# EAGLE schematic precharge_schematic (EAGLE 9.6.2)

## Sheet 1 of 2
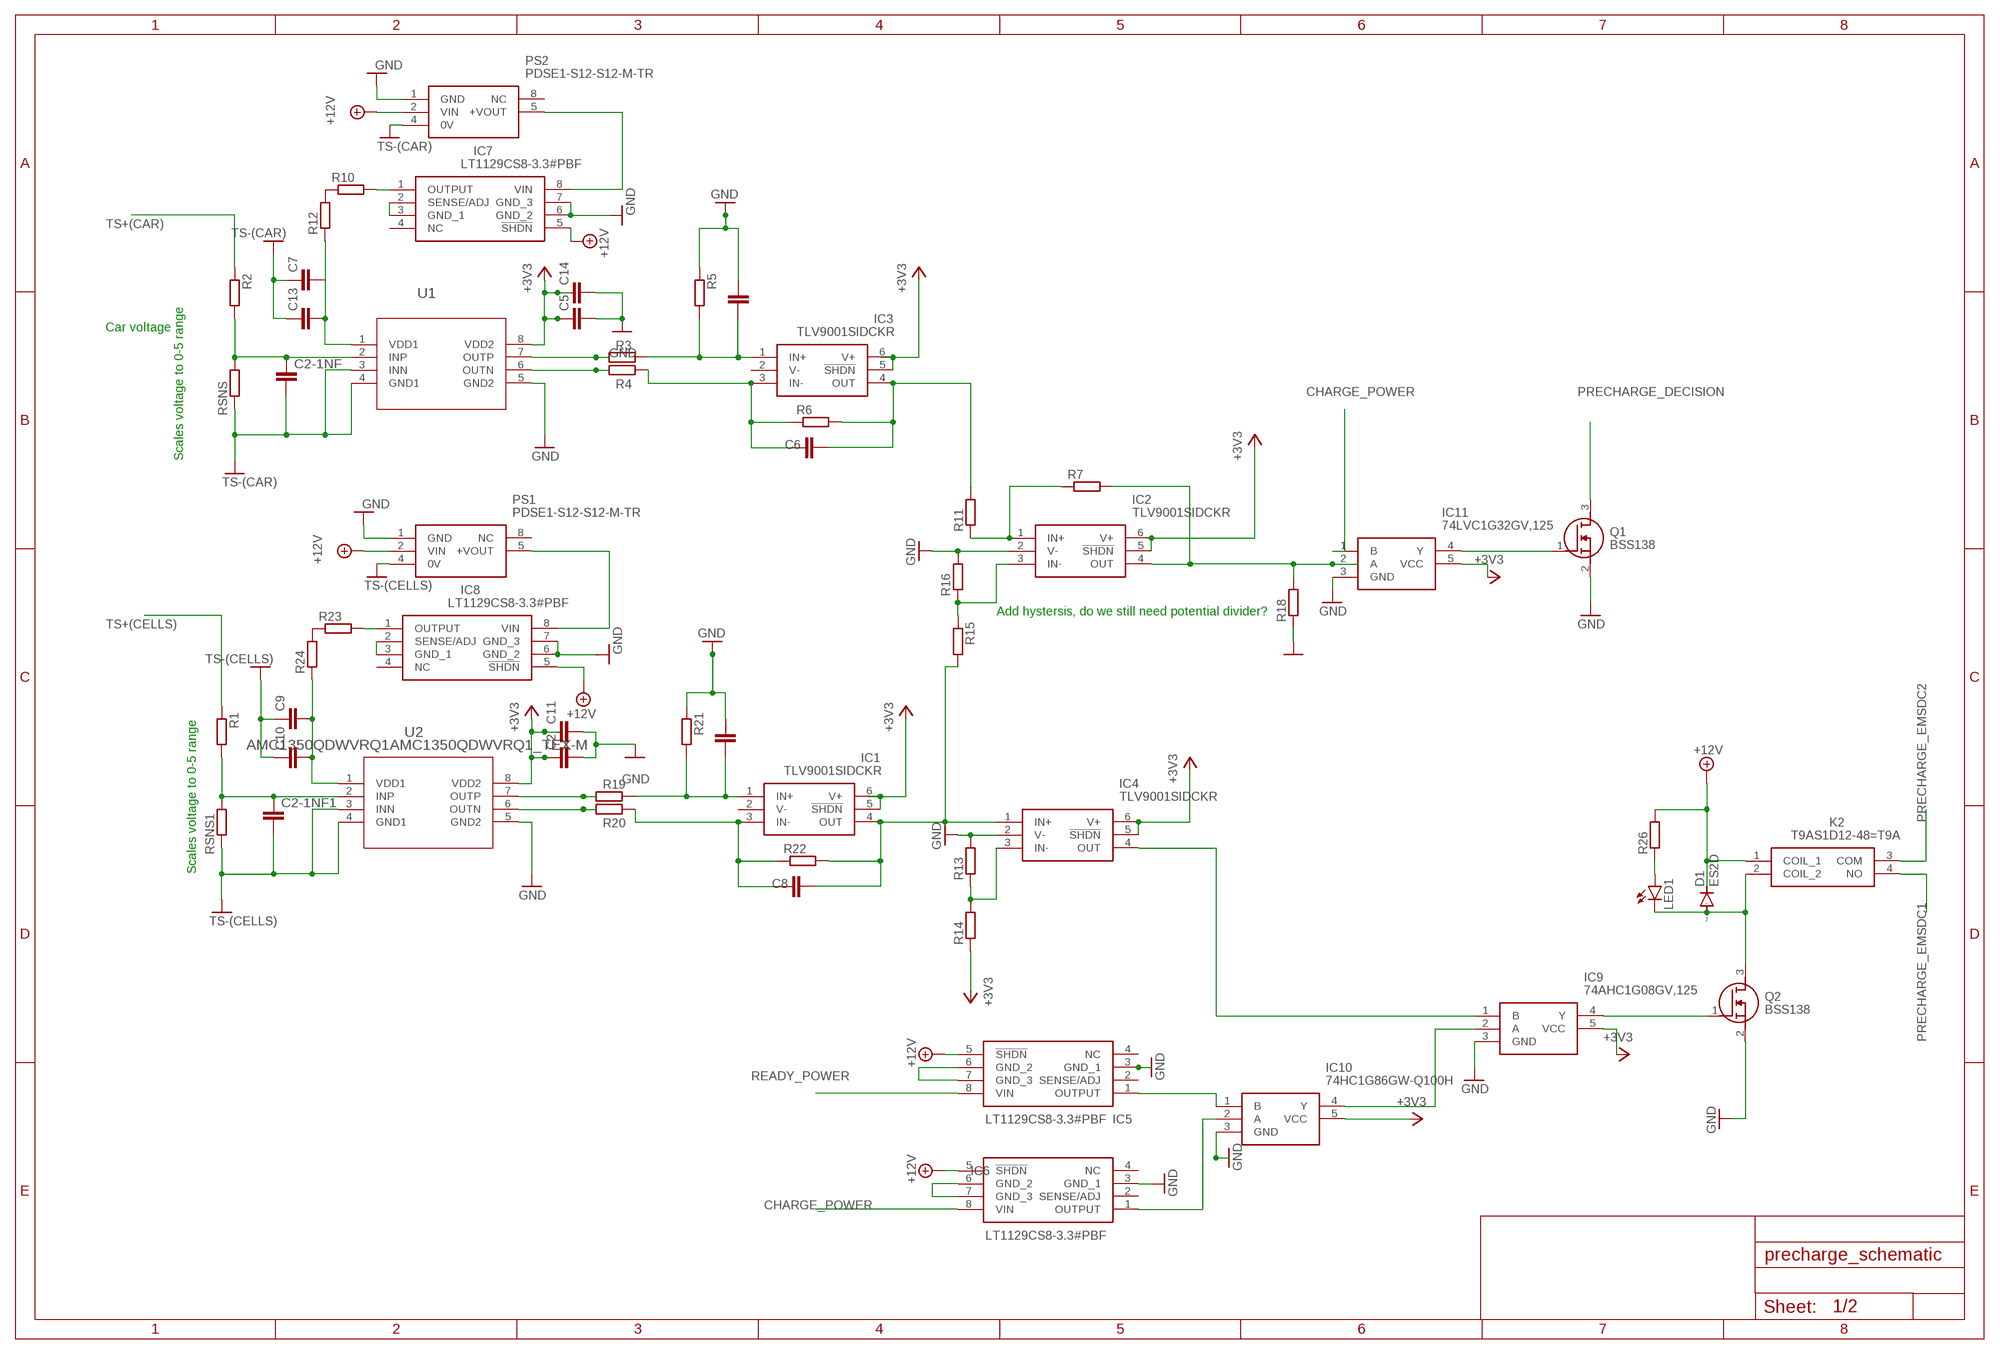
[diagram p0: schematic, sheet 1]

### Parts
C1  C-EUC0805  [C0805]
C2  C-EUC0805  [C0805]
C2-1NF  C-EUC0805  [C0805]
C2-1NF1  C-EUC0805  [C0805]
C3  C-EUC0805  [C0805]
C5  C-EUC0805  [C0805]
C6  C-EUC0805  [C0805]
C7  C-EUC0805  [C0805]
C8  C-EUC0805  [C0805]
C9  C-EUC0805  [C0805]
C10  C-EUC0805  [C0805]
C11  C-EUC0805  [C0805]
C13  C-EUC0805  [C0805]
C14  C-EUC0805  [C0805]
D1  ES2D  [SMB]
IC1  TLV9001SIDCKR  [SOT65P210X110-6N]
IC2  TLV9001SIDCKR  [SOT65P210X110-6N]
IC3  TLV9001SIDCKR  [SOT65P210X110-6N]
IC4  TLV9001SIDCKR  [SOT65P210X110-6N]
IC5  LT1129CS8-3.3#PBF  [SOIC127P599X175-8N]
IC6  LT1129CS8-3.3#PBF  [SOIC127P599X175-8N]
IC7  LT1129CS8-3.3#PBF  [SOIC127P599X175-8N]
IC8  LT1129CS8-3.3#PBF  [SOIC127P599X175-8N]
IC9  74AHC1G08GV,125  [SOT95P275X110-5N]
IC10  74HC1G86GW-Q100H  [SOT65P212X110-5N]
IC11  74LVC1G32GV,125  [SOT95P275X110-5N]
K2  T9AS1D12-48=T9A  [T9AS1D1248T9A]
LED1  LEDSML0805  [SML0805]
PS1  PDSE1-S12-S12-M-TR  [PDSE1S12S12MTR]
PS2  PDSE1-S12-S12-M-TR  [PDSE1S12S12MTR]
Q1  BSS138  [SOT95P240X120-3N]
Q2  BSS138  [SOT95P240X120-3N]
R1  R-EU_R0805  [R0805]
R2  R-EU_R0805  [R0805]
R3  R-EU_R0805  [R0805]
R4  R-EU_R0805  [R0805]
R5  R-EU_R0805  [R0805]
R6  R-EU_R0805  [R0805]
R7  R-EU_R0805  [R0805]
R10  R-EU_R0805  [R0805]
R11  R-EU_R0805  [R0805]
R12  R-EU_R0805  [R0805]
R13  R-EU_R0805  [R0805]
R14  R-EU_R0805  [R0805]
R15  R-EU_R0805  [R0805]
R16  R-EU_R0805  [R0805]
R18  R-EU_R0805  [R0805]
R19  R-EU_R0805  [R0805]
R20  R-EU_R0805  [R0805]
R21  R-EU_R0805  [R0805]
R22  R-EU_R0805  [R0805]
R23  R-EU_R0805  [R0805]
R24  R-EU_R0805  [R0805]
R26  R-EU_M0805  [M0805]
RSNS  R-EU_R0805  [R0805]
RSNS1  R-EU_R0805  [R0805]
U1  AMC1350QDWVRQ1AMC1350QDWVRQ1_TEX-M  [AMC1350QDWVRQ1_TEX-M]
U2  AMC1350QDWVRQ1AMC1350QDWVRQ1_TEX-M  [AMC1350QDWVRQ1_TEX-M]

### Nets
3V3: C2.1 C5.1 C11.1 C14.1 IC1.5(!SHDN) IC1.6(V+) IC2.5(!SHDN) IC2.6(V+) IC3.5(!SHDN) IC3.6(V+) IC4.5(!SHDN) IC4.6(V+) IC9.5(VCC) IC10.5(VCC) IC11.5(VCC) R14.1 U1.8(VDD2) U2.8(VDD2) ; supply symbol labelled +3V3
+12V: D1.C IC5.5(!SHDN) IC6.5(!SHDN) IC7.5(!SHDN) IC8.5(!SHDN) K2.1(COIL_1) PS1.2(VIN) PS2.2(VIN) R26.2
CHARGE_POWER: IC6.8(VIN) IC11.1(B)
GND: C1.1 C2.2 C3.1 C5.2 C11.2 C14.2 IC2.2(V-) IC4.2(V-) IC5.3(GND_1) IC6.3(GND_1) IC7.6(GND_2) IC7.7(GND_3) IC8.6(GND_2) IC8.7(GND_3) IC9.3(GND) IC10.3(GND) IC11.3(GND) PS1.1(GND) PS2.1(GND) Q1.2(S) Q2.2(S) R5.1 R13.2 R16.2 R18.1 R21.1 U1.5(GND2) U2.5(GND2)
GND(LV): C2-1NF1.2 C2-1NF.2 C7.1 C9.1 C10.1 C13.1 PS1.4(0V) PS2.4(0V) RSNS1.1 RSNS.1 U1.3(INN) U1.4(GND1) U2.3(INN) U2.4(GND1) ; supply symbol labelled TS-(CAR), TS-(CELLS) ; also sheet 2
N$1: C2-1NF.1 R2.2 RSNS.2 U1.2(INP)
N$2: C6.2 IC3.4(OUT) R6.2 R11.2
N$3: R4.1 U1.6(OUTN)
N$4: R3.1 U1.7(OUTP)
N$5: C2-1NF1.1 R1.2 RSNS1.2 U2.2(INP)
N$6: C3.2 IC3.1(IN+) R3.2 R5.2
N$7: C6.1 IC3.3(IN-) R4.2 R6.1
N$8: IC2.4(OUT) IC11.2(A) R7.2 R18.2
N$9: R19.1 U2.7(OUTP)
N$10: R20.1 U2.6(OUTN)
N$11: C1.2 IC1.1(IN+) R19.2 R21.2
N$13: C8.1 IC1.3(IN-) R20.2 R22.1
N$15: IC8.2(SENSE/ADJ) IC8.3(GND_1)
N$16: C8.2 IC1.4(OUT) IC2.3(IN-) IC4.1(IN+) R15.1 R15.2 R16.1 R22.2
N$17: IC4.3(IN-) R13.1 R14.2
N$18: IC2.1(IN+) R7.1 R11.1
N$19: IC4.4(OUT) IC9.1(B)
N$20: IC8.8(VIN) PS1.5(+VOUT)
N$21: R23.1 R24.2
N$22: R12.1
N$23: IC7.2(SENSE/ADJ) IC7.3(GND_1)
N$24: IC7.8(VIN) PS2.5(+VOUT)
N$25: R10.1 R12.2
N$26: IC8.1(OUTPUT) R23.2
N$27: IC7.1(OUTPUT) R10.2
N$28: C9.2 C10.2 R24.1 U2.1(VDD1)
N$29: C7.2 C13.2 U1.1(VDD1)
N$30: D1.A K2.2(COIL_2) LED1.C Q2.3(D)
N$31: LED1.A R26.1
N$32: IC6.1(OUTPUT) IC10.2(A)
N$33: IC5.1(OUTPUT) IC10.1(B)
N$34: IC9.2(A) IC10.4(Y)
N$35: IC9.4(Y) Q2.1(G)
N$36: IC6.6(GND_2) IC6.7(GND_3)
N$37: IC5.6(GND_2) IC5.7(GND_3)
N$38: IC11.4(Y) Q1.1(G)
PRECHARGE_DECISION: Q1.3(D) ; also sheet 2
PRECHARGE_EMSDC1: K2.4(NO) ; also sheet 2
PRECHARGE_EMSDC2: K2.3(COM) ; also sheet 2
READY_POWER: IC5.8(VIN)
TS+(CAR): R2.1 ; also sheet 2
TS+(CELLS): R1.1 ; also sheet 2
Unconnected: IC1.2(V-) IC3.2(V-) IC5.2(SENSE/ADJ) IC5.4(NC) IC6.2(SENSE/ADJ) IC6.4(NC) IC7.4(NC) IC8.4(NC) PS1.8(NC) PS2.8(NC)

### Notes on the sheet
- Car voltage
- Scales voltage to 0-5 range
- Add hystersis, do we still need potential divider?
- Scales voltage to 0-5 range

## Sheet 2 of 2
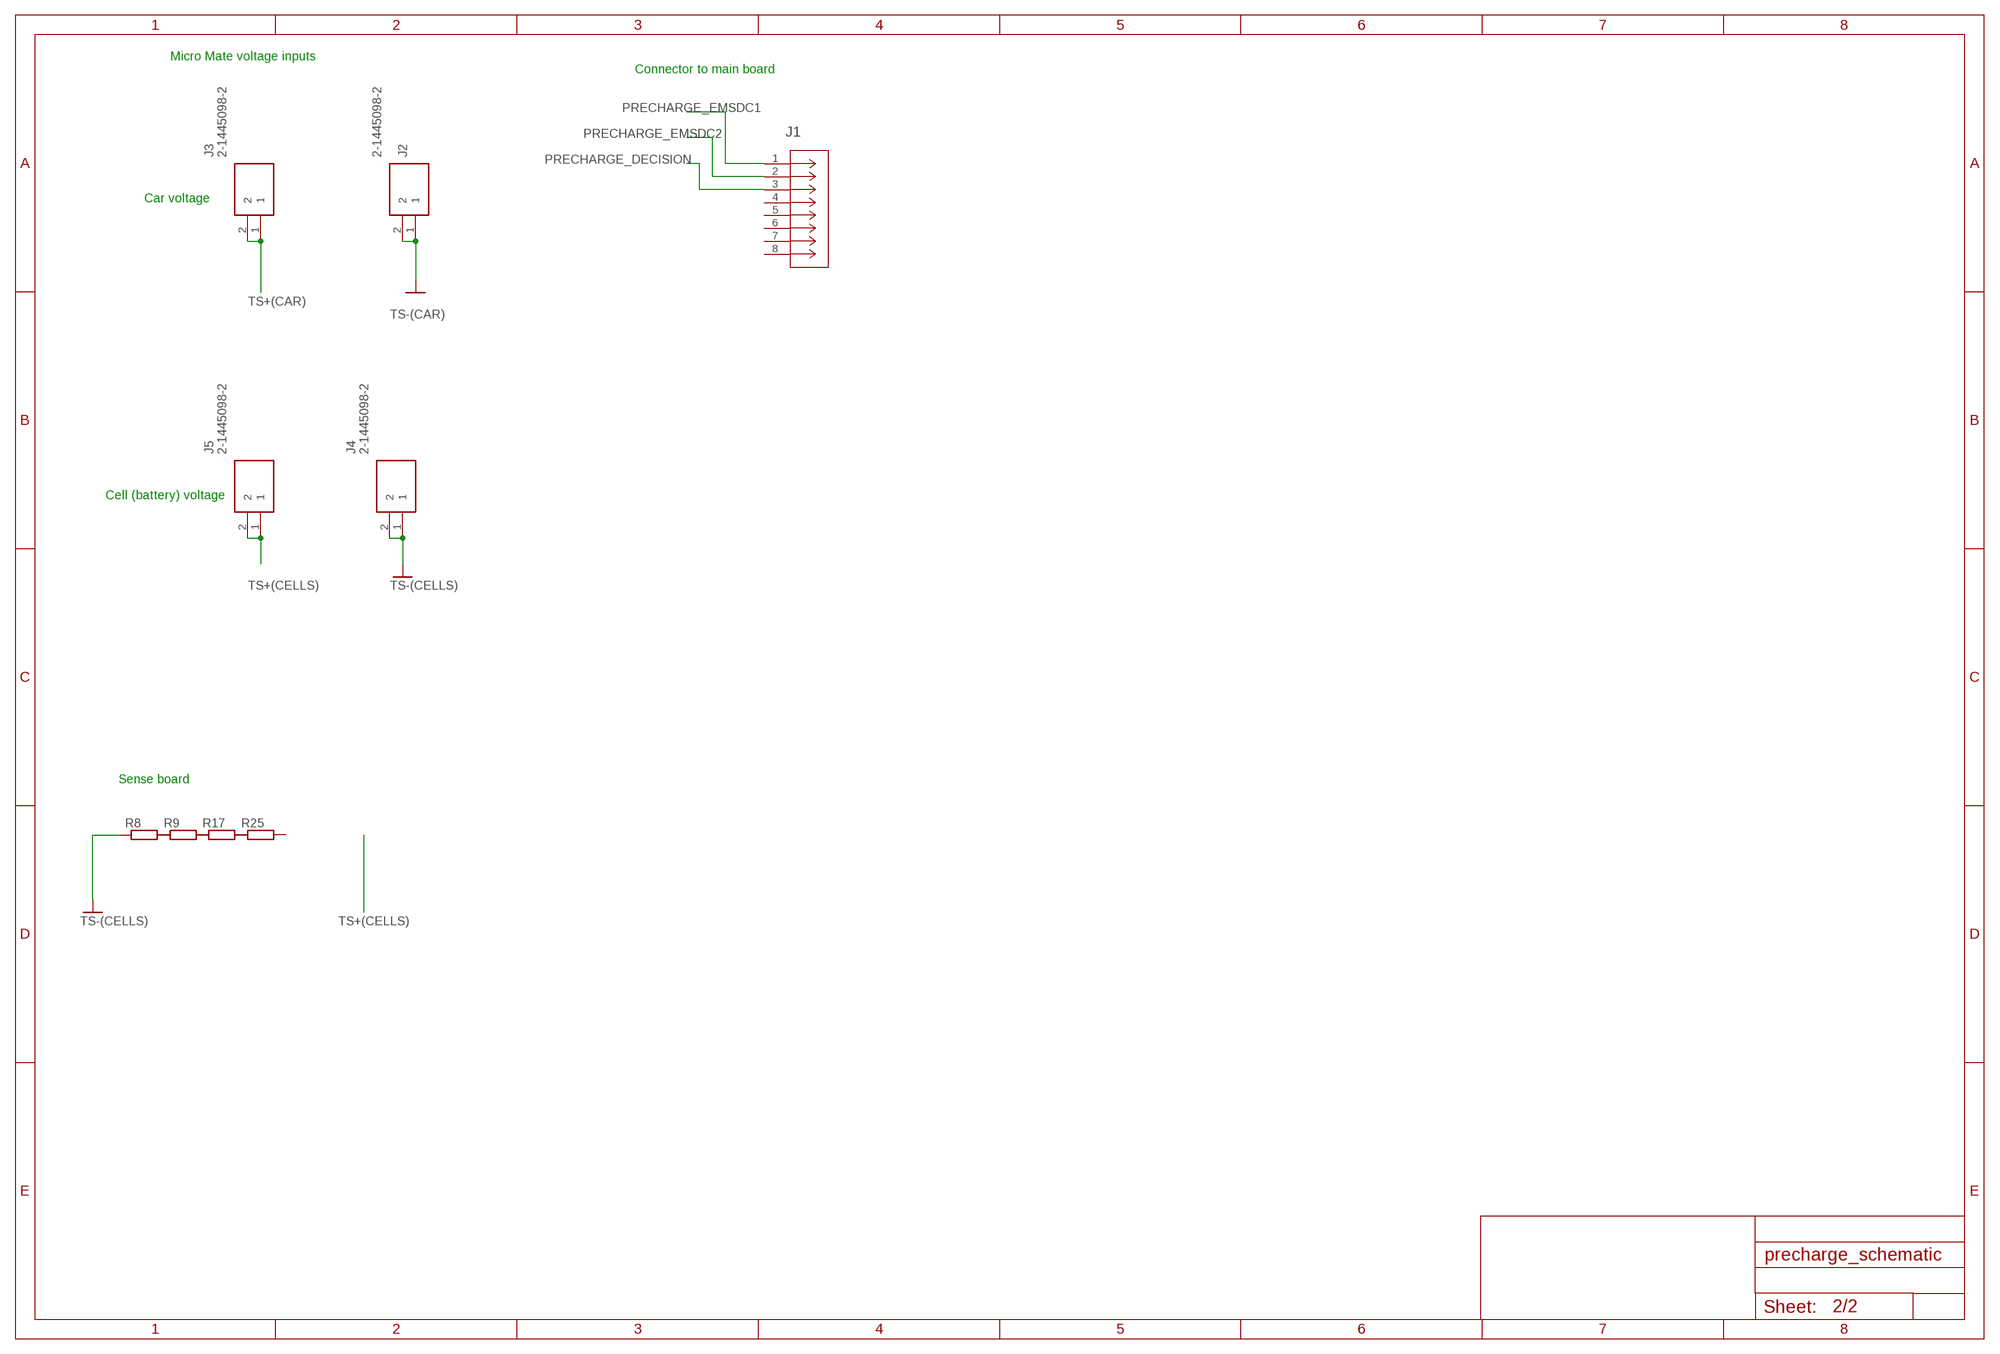
[diagram p1: schematic, sheet 2]

### Parts
J1  MINI-SPOX_22035085  [CON_22035085_MOL]
J2  2-1445098-2  [214450982]
J3  2-1445098-2  [214450982]
J4  2-1445098-2  [214450982]
J5  2-1445098-2  [214450982]
R8  R-EU_R0805W  [R0805W]
R9  R-EU_R0805W  [R0805W]
R17  R-EU_R0805W  [R0805W]
R25  R-EU_R0805W  [R0805W]

### Nets
GND(LV): R8.1 ; supply symbol labelled TS-(CELLS) ; also sheet 1
N$12: J2.1 J2.2 ; supply symbol labelled TS-(CAR)
N$14: J4.1 J4.2 ; supply symbol labelled TS-(CELLS)
PRECHARGE_DECISION: J1.3 ; also sheet 1
PRECHARGE_EMSDC1: J1.1 ; also sheet 1
PRECHARGE_EMSDC2: J1.2 ; also sheet 1
TS+(CAR): J3.1 J3.2 ; also sheet 1
TS+(CELLS): J5.1 J5.2 ; also sheet 1
Unconnected: J1.4 J1.5 J1.6 J1.7 J1.8 R8.2 R9.1 R9.2 R17.1 R17.2 R25.1 R25.2

### Notes on the sheet
- Micro Mate voltage inputs
- Connector to main board
- Car voltage
- Cell (battery) voltage
- Sense board

## Library data of the parts
C1 C2 C2-1NF C2-1NF1 C3 C5-C11 C13 C14 = rcl:C-EU: CAPACITOR, European symbol; SPICEPREFIX: C
D1 = diode:ES2D: DIODE super fast rectifier, 2 A
IC1-IC4 = TLV9001SIDCKR:TLV9001SIDCKR: Operational Amplifiers - Op Amps 1-Channel, 1MHz, RRIO, 1.8V to 5.5V Operational Amplifier for Cost-Optimized Systems 6-SC70 -40 to 125 Source: Datasheet <https://www.ti.com/lit/ds/symlink/tlv9001.pdf?&ts=1589463649736>; ARROW_PART_NUMBER: TLV9001SIDCKR; ARROW_PRICE-STOCK: https://www.arrow.com/en/products/tlv9001sidckr/texas-instruments?region=nac; DESCRIPTION: Operational Amplifiers - Op Amps 1-Channel, 1MHz, RRIO, 1.8V to 5.5V Operational Amplifier for Cost-Optimized Systems 6-SC70 -40 to 125; HEIGHT: 1.1mm; MANUFACTURER_NAME: Texas Instruments; MANUFACTURER_PART_NUMBER: TLV9001SIDCKR; MOUSER_PART_NUMBER: 595-TLV9001SIDCKR; MOUSER_PRICE-STOCK: https://www.mouser.co.uk/ProductDetail/Texas-Instruments/TLV9001SIDCKR?qs=OlC7AqGiEDm%252BHGQGq0Yv1w%3D%3D
IC5-IC8 = LT1129CS8-3.3#PBF:LT1129CS8-3.3#PBF: Linear Technology LT1129CS8-3.3#PBF, LDO Voltage Regulator, 700mA, 3.3 V, -30 30 Vin, 8-Pin Source: Datasheet <http://cds.linear.com/docs/en/datasheet/112935ff.pdf>; ARROW_PART_NUMBER: LT1129CS8-3.3#PBF; ARROW_PRICE-STOCK: https://www.arrow.com/en/products/lt1129cs8-3.3pbf/analog-devices?region=nac; DESCRIPTION: Linear Technology LT1129CS8-3.3#PBF, LDO Voltage Regulator, 700mA, 3.3 V, -30 30 Vin, 8-Pin; HEIGHT: 1.752mm; MANUFACTURER_NAME: Analog Devices; MANUFACTURER_PART_NUMBER: LT1129CS8-3.3#PBF; MOUSER_PART_NUMBER: 584-LT1129CS8-3.3PBF; MOUSER_PRICE-STOCK: https://www.mouser.co.uk/ProductDetail/Analog-Devices/LT1129CS8-3.3PBF?qs=ytflclh7QUUPxIiRT3KdTw%3D%3D
IC9 = 74AHC1G08GV_125:74AHC1G08GV,125: 74AHC(T)1G08 - 2-input AND gate@en-us Source: Datasheet <https://assets.nexperia.com/documents/data-sheet/74AHC_AHCT1G08.pdf>; ARROW_PART_NUMBER: 74AHC1G08GV,125; ARROW_PRICE-STOCK: https://www.arrow.com/en/products/74ahc1g08gv125/nexperia?region=nac; DESCRIPTION: 74AHC(T)1G08 - 2-input AND gate@en-us; HEIGHT: 1.1mm; MANUFACTURER_NAME: Nexperia; MANUFACTURER_PART_NUMBER: 74AHC1G08GV,125; MOUSER_PART_NUMBER: 771-AHC1G08GV125; MOUSER_PRICE-STOCK: https://www.mouser.co.uk/ProductDetail/Nexperia/74AHC1G08GV125?qs=P62ublwmbi9ONADOQCr7Sg%3D%3D
IC10 = 74HC1G86GW-Q100H:74HC1G86GW-Q100H: 74HC(T)1G86-Q100 - 2-input EXCLUSIVE-OR gate@en-us Source: Datasheet <https://assets.nexperia.com/documents/data-sheet/74HC_HCT1G86_Q100.pdf>; ARROW_PART_NUMBER: 74HC1G86GW-Q100H; ARROW_PRICE-STOCK: https://www.arrow.com/en/products/74hc1g86gw-q100h/nexperia?region=nac; DESCRIPTION: 74HC(T)1G86-Q100 - 2-input EXCLUSIVE-OR gate@en-us; HEIGHT: 1.1mm; MANUFACTURER_NAME: Nexperia; MANUFACTURER_PART_NUMBER: 74HC1G86GW-Q100H; MOUSER_PART_NUMBER: 771-74HC1G86GW-Q100H; MOUSER_PRICE-STOCK: https://www.mouser.co.uk/ProductDetail/Nexperia/74HC1G86GW-Q100H?qs=5XOdhvmYM0PgVyXumaLcbw%3D%3D
IC11 = 74LVC1G32GV_125:74LVC1G32GV,125: NEXPERIA - 74LVC1G32GV,125 - OR GATE, SINGLE, 2 I/P, SC-74A-5 Source: Datasheet <https://assets.nexperia.com/documents/data-sheet/74LVC1G32.pdf>; ARROW_PART_NUMBER: 74LVC1G32GV,125; ARROW_PRICE-STOCK: https://www.arrow.com/en/products/74lvc1g32gv125/nexperia?region=asia; DESCRIPTION: NEXPERIA - 74LVC1G32GV,125 - OR GATE, SINGLE, 2 I/P, SC-74A-5; HEIGHT: 1.1mm; MANUFACTURER_NAME: Nexperia; MANUFACTURER_PART_NUMBER: 74LVC1G32GV,125; MOUSER_PART_NUMBER: 771-LVC1G32GV125; MOUSER_PRICE-STOCK: https://www.mouser.co.uk/ProductDetail/Nexperia/74LVC1G32GV125?qs=me8TqzrmIYXExQH4V9SARg%3D%3D
J1 = Mini-spox_22035085:MINI-SPOX_22035085; COPYRIGHT: Copyright (C) 2023 Ultra Librarian. All rights reserved.; MANUFACTURER_PART_NUMBER: 22035085; MFR_NAME: Molex Connector Corporation
J2-J5 = Micro-mate 2-1445098-2:2-1445098-2: Micro Mate-N-Lok Header shrouded 2way Source: Datasheet <https://www.te.com/commerce/DocumentDelivery/DDEController?Action=showdoc&DocId=Customer Drawing1445098A4pdfEnglishENG_CD_1445098_A4.pdf2-1445098-2>; ARROW_PART_NUMBER: 2-1445098-2; ARROW_PRICE-STOCK: https://www.arrow.com/en/products/2-1445098-2/te-connectivity; DESCRIPTION: Micro Mate-N-Lok Header shrouded 2way; HEIGHT: 5.67mm; MANUFACTURER_NAME: TE Connectivity; MANUFACTURER_PART_NUMBER: 2-1445098-2; MOUSER_PART_NUMBER: 571-2-1445098-2; MOUSER_PRICE-STOCK: https://www.mouser.co.uk/ProductDetail/TE-Connectivity-AMP/2-1445098-2?qs=Eu63EZxBwKKSsdV7%2Fa6T1Q%3D%3D
K2 = T9AS1D12-12=T9A:T9AS1D12-48=T9A: SPST-NO PCB Mount Non-Latching Relay Through Hole, 48V dc Source: Datasheet <https://www.te.com/commerce/DocumentDelivery/DDEController?Action=showdoc&DocId=Data Sheet1308242_T9A0915pdfEnglishENG_DS_1308242_T9A_0915.pdf1-1393210-9>; DESCRIPTION: SPST-NO PCB Mount Non-Latching Relay Through Hole, 48V dc; HEIGHT: 20.4mm; MANUFACTURER_NAME: TE Connectivity; MANUFACTURER_PART_NUMBER: T9AS1D12-48=T9A
LED1 = led:LED: LED OSRAM: - CHIPLED LG R971, LG N971, LY N971, LG Q971, LY Q971, LO R971, LY R971 LH N974, LH R974 LS Q976, LO Q976, LY Q976 LO Q996 - Hyper CHIPLED LW Q18S LB Q993, LB Q99A, LB R99A - SideLED LS A670, LO A670, LY A670, LG A670, LP A670 LB A673, LV A673, LT A673, LW A673 LH A674 LY A675 LS A676, LA A676, LO A676, LY A676, LW A676 LS A679, LY A679, LG A679 - Hyper Micro SIDELED® LS Y876, LA Y876, LO Y876, LY Y876 LT Y87S - SmartLED LW L88C, LW L88S LB L89C, LB L89S, LG L890 LS L89K, LO L89K, LY L89K LS L896, LA L896, LO L896, LY L896 - TOPLED LS T670, LO T670, LY T670, LG T670, LP T670 LSG T670, LSP T670, LSY T670, LOP T670, LYG T670 LG T671, LOG T671, LSG T671 LB T673, LV T673, LT T673, LW T673 LH T674 LS T676, LA T676, LO T676, LY T676, LB T676, LH T676, LSB T676, LW T676 LB T67C, LV T67C, LT T67C, LS T67K, LO T67K, LY T67K, LW E67C LS E67B, LA E67B, LO E67B, LY E67B, LB E67C, LV E67C, LT E67C LW T67C LS T679, LY T679, LG T679 LS T770, LO T770, LY T770, LG T770, LP T770 LB T773, LV T773, LT T773, LW T773 LH T774 LS E675, LA E675, LY E675, LS T675 LS T776, LA T776, LO T776, LY T776, LB T776 LHGB T686 LT T68C, LB T68C - Hyper Mini TOPLED® LB M676 - Mini TOPLED Santana® LG M470 LS M47K, LO M47K, LY M47K Source: http://www.osram.convergy.de LUXEON: - LUMILED® LXK2-PW12-R00, LXK2-PW12-S00, LXK2-PW14-U00, LXK2-PW14-V00 LXK2-PM12-R00, LXK2-PM12-S00, LXK2-PM14-U00 LXK2-PE12-Q00, LXK2-PE12-R00, LXK2-PE12-S00, LXK2-PE14-T00, LXK2-PE14-U00 LXK2-PB12-K00, LXK2-PB12-L00, LXK2-PB12-M00, LXK2-PB14-N00, LXK2-PB14-P00, LXK2-PB14-Q00 LXK2-PR12-L00, LXK2-PR12-M00, LXK2-PR14-Q00, LXK2-PR14-R00 LXK2-PD12-Q00, LXK2-PD12-R00, LXK2-PD12-S00 LXK2-PH12-R00, LXK2-PH12-S00 LXK2-PL12-P00, LXK2-PL12-Q00, LXK2-PL12-R00 Source: www.luxeon.com KINGBRIGHT: KA-3528ASYC Source: www.kingbright.com
PS1 PS2 = PDSE1-S12-S12-M-TR:PDSE1-S12-S12-M-TR: Isolated DC/DC Converters Source: Datasheet <https://www.cui.com/product/resource/pdse1-m.pdf>; DESCRIPTION: Isolated DC/DC Converters; HEIGHT: 7.5mm; MANUFACTURER_NAME: CUI Inc.; MANUFACTURER_PART_NUMBER: PDSE1-S12-S12-M-TR; MOUSER_PART_NUMBER: 490-PDSE1-S12-S12MTR; MOUSER_PRICE-STOCK: https://www.mouser.co.uk/ProductDetail/CUI-Inc/PDSE1-S12-S12-M-TR?qs=Jslch3jnSjmXCGD3QPvcow%3D%3D
Q1 Q2 = BSS138:BSS138: N-channel MOSFET,BSS138 0.2A 50V Source: Datasheet <https://www.onsemi.com/pub/Collateral/BSS138-D.PDF>; ARROW_PART_NUMBER: BSS138; ARROW_PRICE-STOCK: https://www.arrow.com/en/products/bss138/on-semiconductor; DESCRIPTION: N-channel MOSFET,BSS138 0.2A 50V; HEIGHT: 1.2mm; MANUFACTURER_NAME: onsemi; MANUFACTURER_PART_NUMBER: BSS138; MOUSER_PART_NUMBER: 512-BSS138; MOUSER_PRICE-STOCK: https://www.mouser.co.uk/ProductDetail/ON-Semiconductor-Fairchild/BSS138?qs=HK%252BeIG1iaahCeqBvjB4arg%3D%3D
R1-R26 RSNS RSNS1 = rcl:R-EU_: RESISTOR, European symbol; SPICEPREFIX: R
U1 U2 = AMC1350QDWVRQ1:AMC1350QDWVRQ1; COPYRIGHT: Copyright (C) 2022 Ultra Librarian. All rights reserved.; MANUFACTURER_PART_NUMBER: AMC1350; MFR_NAME: Texas Instruments

## Net classes
3 power: width 0.889 mm